# Altium schematic sheet SWD_OVER_USB_C.SchDoc
size A3; SheetNumber: 5; SheetTotal: 7
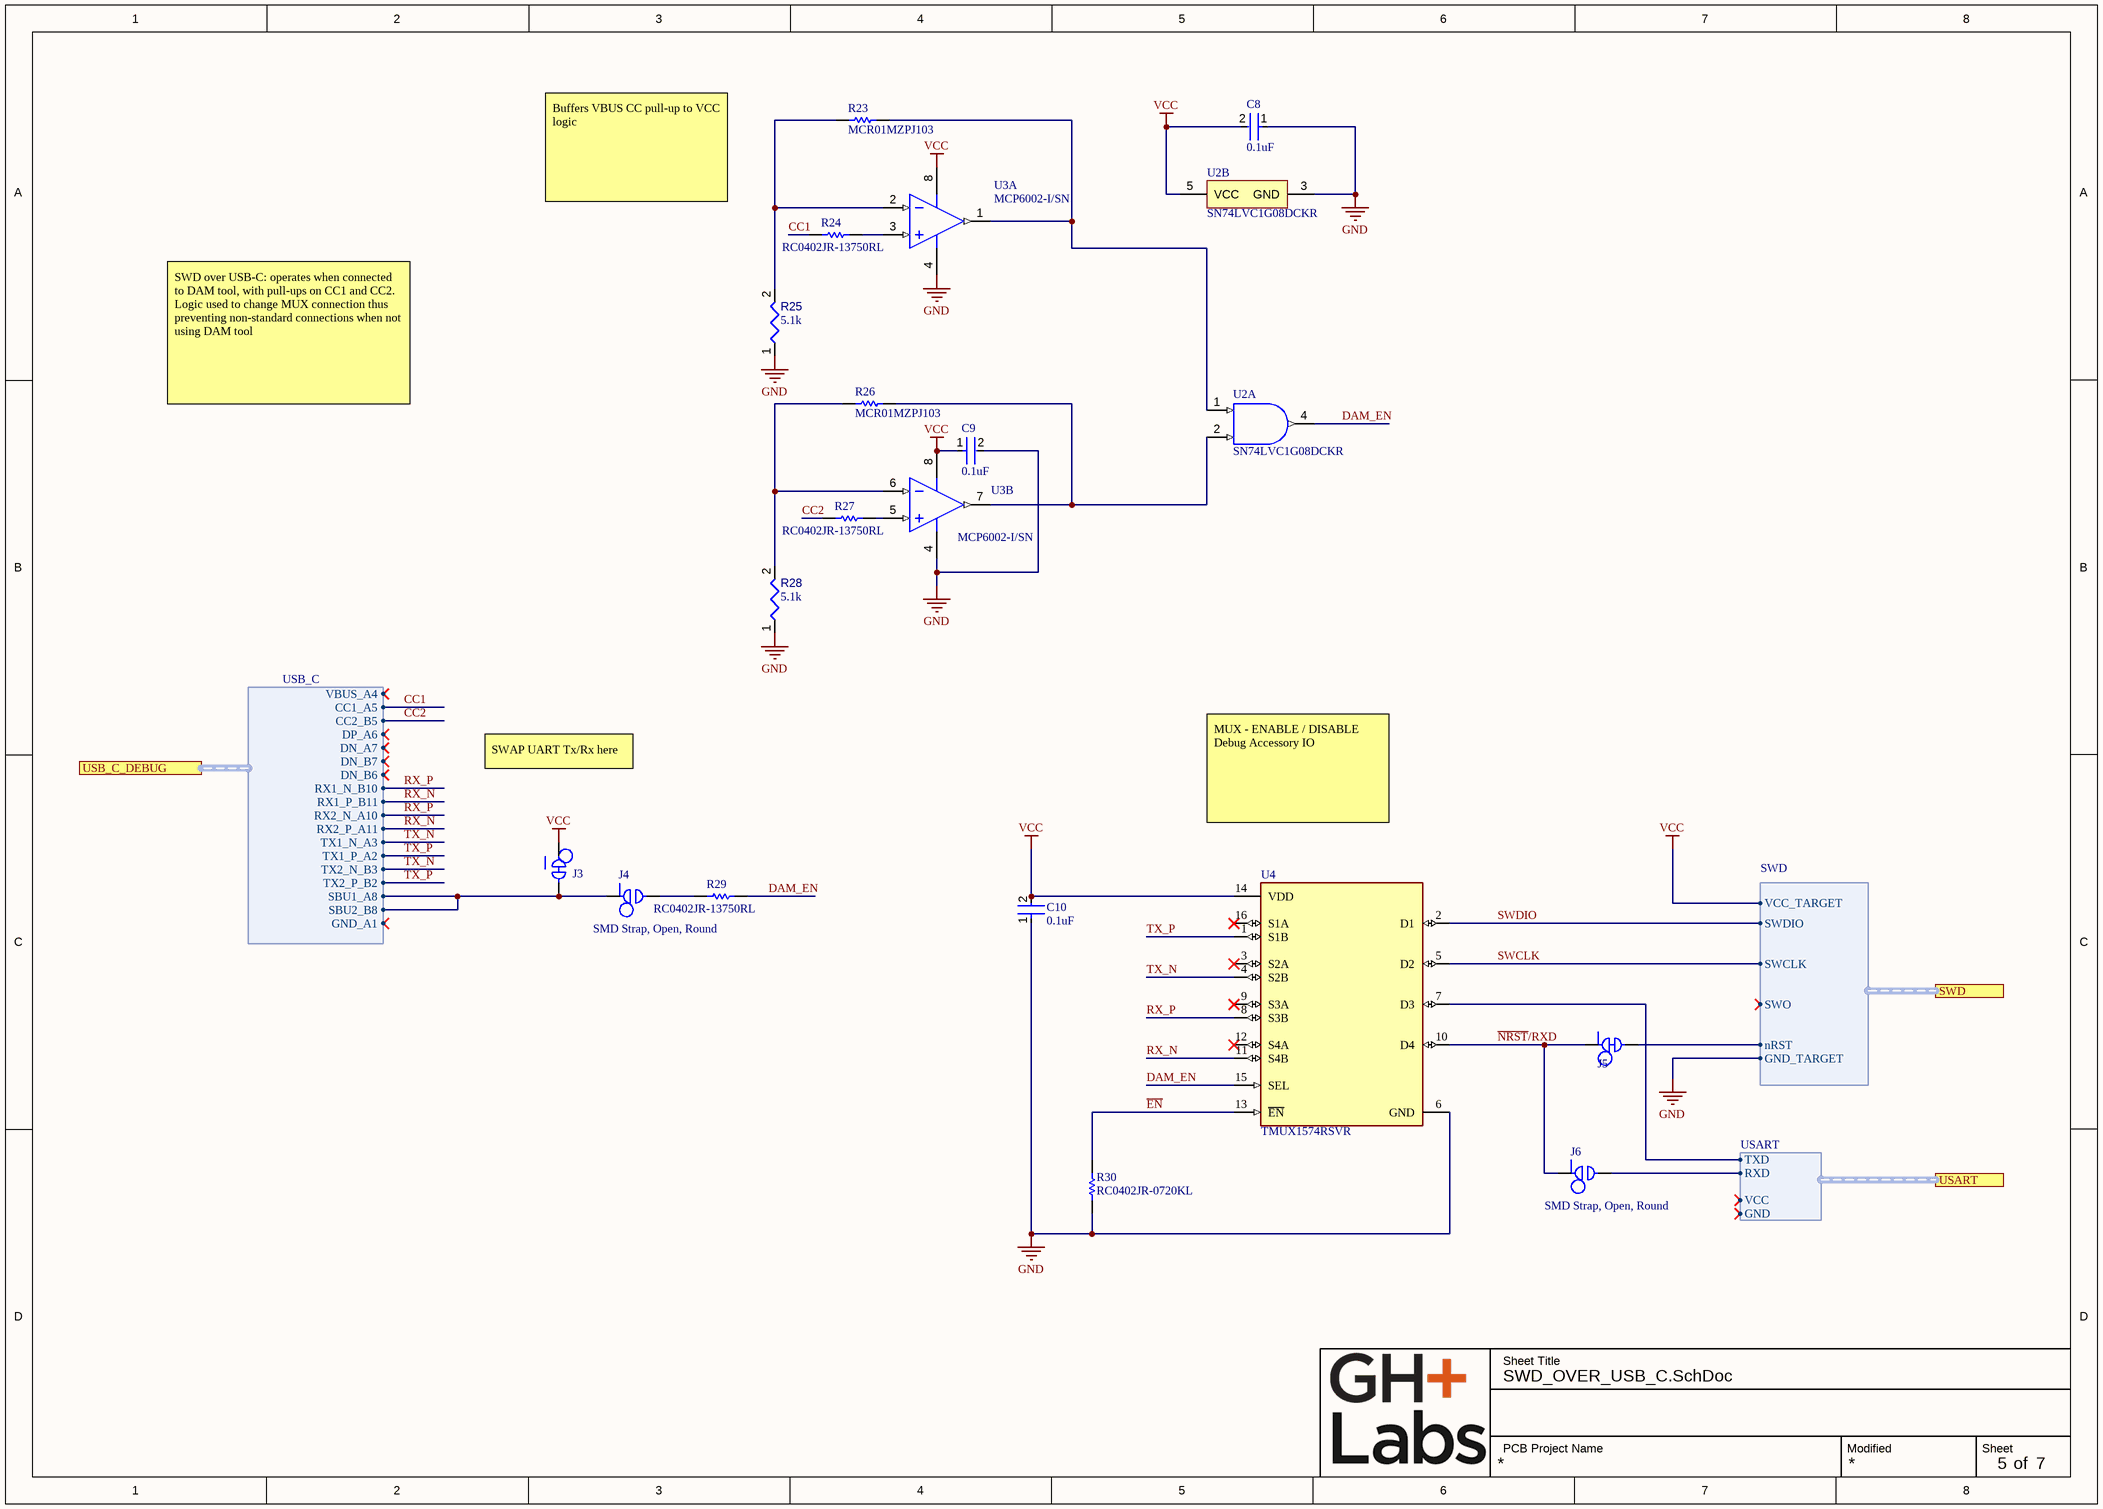
[diagram p0: SWD_OVER_USB_C.SchDoc]

## Parts
C8  0.1uF  [FP-CL17-IPC_C]
C9  0.1uF  [FP-CL17-IPC_C]
C10  0.1uF  [FP-CL17-IPC_C]
J3  SMD Strap, 0603, Closed  [JMP-0603-STRAP-CLOSED]  (value not drawn)  (net tie, no BOM)
J4  SMD Strap, Open, Round  [Open Link, Atmel Design]  (net tie, no BOM)
J5  SMD Strap, 0603, Closed  [JMP-0603-STRAP-CLOSED]  (value not drawn)  (net tie, no BOM)
J6  SMD Strap, Open, Round  [Open Link, Atmel Design]  (net tie, no BOM)
R23  MCR01MZPJ103  [RESC1005X40X23LL05T08]
R24  RC0402JR-13750RL  [RESC1005X40X25LL05T10]
R25  value 5.1k  [RESC0402(1005)_L]  (hidden comment: Resistor 5K1 +/-1 % 0402 63 mW)
R26  MCR01MZPJ103  [RESC1005X40X23LL05T08]
R27  RC0402JR-13750RL  [RESC1005X40X25LL05T10]
R28  value 5.1k  [RESC0402(1005)_L]  (hidden comment: Resistor 5K1 +/-1 % 0402 63 mW)
R29  RC0402JR-13750RL  [RESC1005X40X25LL05T10]
R30  RC0402JR-0720KL  [RESC1005X40X25NL05T10]
U2  SN74LVC1G08DCKR  [DCK0005A_M]  (parts A,B of 2)
U3  MCP6002-I/SN  [SOIC-SN8_M]  (parts A,B of 2)
U4  TMUX1574RSVR  [FP-RSV0016A-MFG]

## Ports
SWD (harness SWD), USART (harness USART), USB_C_DEBUG (harness USB_C)

## Harnesses
USB_C: VBUS_A4, CC1_A5, CC2_B5, DN_A7, DP_A6, DN_B7, DN_B6, RX1_N_B10, RX1_P_B11, RX2_N_A10, RX2_P_A11, TX1_N_A3, TX1_P_A2, TX2_N_B3, TX2_P_B2, SBU1_A8, SBU2_B8, GND_A1
SWD: GND_TARGET, nRST, SWCLK, SWDIO, SWO, VCC_TARGET
USART: GND, RXD, TXD, VCC

## Nets
GND: C8.1 C9.2 C10.1 R25.1 R28.1 R30.1 U2.3(GND) U3.4(VSS) U4.6(GND) ; port SWD.GND_TARGET
VCC: C8.2 C9.1 C10.2 J3.1 U2.5(VCC) U3.8(VDD) U4.14(VDD) ; port SWD.VCC_TARGET
CC1: R24.1 ; port USB_C_DEBUG.CC1_A5
CC2: R27.1 ; port USB_C_DEBUG.CC2_B5
DAM_EN: R29.2 U2.4(Y) U4.15(SEL)
~{EN}: R30.2 U4.13(~{EN})
~{NRST}/RXD: J5.1 J6.1 U4.10(D4)
RX_N: U4.11(S4B) ; port USB_C_DEBUG.RX1_P_B11, port USB_C_DEBUG.RX2_P_A11
RX_P: U4.8(S3B) ; port USB_C_DEBUG.RX1_N_B10, port USB_C_DEBUG.RX2_N_A10
SWCLK: U4.5(D2) ; port SWD.SWCLK
SWDIO: U4.2(D1) ; port SWD.SWDIO
TX_N: U4.4(S2B) ; port USB_C_DEBUG.TX1_N_A3, port USB_C_DEBUG.TX2_N_B3
TX_P: U4.1(S1B) ; port USB_C_DEBUG.TX1_P_A2, port USB_C_DEBUG.TX2_P_B2
NetJ3_2: J3.2 J4.1 ; port USB_C_DEBUG.SBU1_A8, port USB_C_DEBUG.SBU2_B8
NetJ4_2: J4.2 R29.1
NetJ5_2: J5.2 ; port SWD.nRST
NetJ6_2: J6.2 ; port USART.RXD
NetR23_1: R23.1 R25.2 U3.2(VINA-)
NetR23_2: R23.2 U2.1(A) U3.1(VOUTA)
NetR24_2: R24.2 U3.3(VINA+)
NetR26_1: R26.1 R28.2 U3.6(VINB-)
NetR26_2: R26.2 U2.2(B) U3.7(VOUTB)
NetR27_2: R27.2 U3.5(VINB+)
NetU4_7: U4.7(D3) ; port USART.TXD

Not connected (* = marked no-connect by the designer): U4 3(S2A)* 9(S3A)* 12(S4A)* 16(S1A)*

## Notes on the sheet
- Buffers VBUS CC pull-up to VCC logic
- SWD over USB-C: operates when connected to DAM tool, with pull-ups on CC1 and CC2. Logic used to change MUX connection thus preventing non-standard connections when not using DAM tool
- SWAP UART Tx/Rx here
- MUX - ENABLE / DISABLE Debug Accessory IO
- Sheet Title
- PCB Project Name
- Modified
- Sheet
- of

## Library data of the parts
C8-C10 = CMP-13271-001069-1: Cap Ceramic 100nF 10V X7R ±10% SMD 0402 +125°C Paper T/R; Height: 0.5mm; Case/Package: 0402; Contact Plating: Tin; Case Code (Imperial): 0402; Capacitance: 100nF; Thickness: 0.022inch; Min Operating Temperature: -55°C; Package Quantity: 1; Length: 1mm; Max Operating Temperature: 125°C; Depth: 0.5mm; Voltage Rating: 10V; Packaging: Tape and Reel; Mount: Surface Mount; Tolerance: 10%; Width: 0.02inch; Radiation Hardening: No; Case Code (Metric): 1005; Dielectric: X7R
J3 J5 = CMP-001-0027-01.A.1
J4 J6 = CMP-001-0038-01.A.1
R23 R26 = CMP-2000-06684-1: Chip Resistor, 10 KOhm, +/- 5%, 63 mW, -55 to 155 degC, 0402 (1005 Metric), RoHS, Tape and Reel; Manufacturer: Rohm; Temp Coefficient: ±200ppm/°C; Resistance: 10kO; Rated Power: 0.063W; Datasheet URL: http://www.rohm.com/web/global/datasheet/MCR01MZPJ; Package Description: 2-Pin Surface Mount Device, Body 1 x 0.5 mm; Tolerance (%): ±5%; Manufacturer URL: http://www.rohm.com/web/global/; Size Code: 1005; Package Reference: 0402; Datasheet Version: Rev. J, 06/2016; Mounting Technology: SurfaceMount
R24 R27 R29 = CMP-2002-08095-1: Manufacturer: Yageo; Part Number: RC0402JR-13750RL
R25 R28 = CMP-009-00177-1: Chip Resistor, 5.1 kOhms, +/-1 %, 63 mW, -55 to 155 degC, 0402; Power: 63mW; Tolerance: 1%; Case/Package: 0402; Pins: 2; RoHS Compliant: Yes; Max Operating Temperature: 155°C; Min Operating Temperature: -55°C; Mounting Technology: Surface Mount
R30 = CMP-2002-07956-1: Manufacturer: Yageo / Phycomp; Part Number: RC0402JR-0720KL
U2 = CMP-0859-00266-3: Single 2-Input Positive-AND Gate, DCK0005A, LARGE T&R; Manufacturer: Texas Instruments; tpd @ Nom Voltage(Max)(ns): 4.5,6,4,5; F @ Nom Voltage(Max)(Mhz): 150; ICC @ Nom Voltage(Max)(mA): 0.01; Bits(#): 1; VCC(Min)(V): 1.65; Gate Type: AND; Rating: Catalog; Output Type: CMOS; Voltage(Nom)(V): 1.8,2.5,3.3,5; Technology Family: LVC; VCC(Max)(V): 5.5; Input Type: CMOS/TTL; Schmitt Trigger: No; Output Drive (IOL/IOH)(Max)(mA): 32/-32; Logic: True; Generic Part Number: SN74LVC1G08; DatasheetVersion: SCES217Y; Sub-Family: AND Gate; 3-State Output: No; Operating Temperature Range(C): -40 to 125,-40 to 85; PackageReference: DCK0005A
U3 = CMP-0187-00365-3: None; Bandwidth: 1MHz; Number of Elements: 2; Power Supply Rejection Ratio (PSRR): 86dB; Nominal Supply Current: 100uA; Max Supply Voltage: 6V; Input Offset Voltage-Max: 4.5mV; Voltage Gain: 112dB; Input Bias Current: 1pA; Min Supply Voltage: 1.8V; Slew Rate: 0.6V/µs; Operating Supply Voltage: 5.5V; Amplifier Type: GENERAL PURPOSE; Output Current: 23mA; Common Mode Rejection Ratio: 60dB; Gain Bandwidth Product: 1MHz; Min Operating Temperature: -40°C; Supply Current: 100uA; Number of Circuits: 2; Package Quantity: 100; Width: 3.9mm; Technology: CMOS; RoHS Compliant: Yes; Radiation Hardening: No; Mount: Surface Mount; Number of Pins: 8; Length: 4.9mm; Case/Package: SOIC; Number of Channels: 2; Max Operating Temperature: 85°C; Unity Gain Bandwidth Product: 1MHz; Lead Free: Lead Free; Number of Amplifiers: 2; REACH SVHC: No SVHC; Slew Rate-Nom: 0.6V/µs; Height: 1.25mm; Input Offset Voltage (Vos): 4.5mV; Packaging: Rail/Tube
U4 = CMP-04892-000064-2: IC SWITCH SPDT QUAD 16UQFN; RoHS Compliant: Yes